# Altium schematic sheet AD8232 & TMP136.SchDoc
size A4; Date: 08-May-2020; ApprovedBy: Vijay; CheckedBy: Vijay; CompanyName: Embdes Engineering Solutions Pvt. Ltd.; DrawnBy: Sandeep G; Organization: Altium Limited; Address1: e2-s.com; DocumentNumber: ECG_BLE.PCBA; Revision: Rev1.0; SheetNumber: 2; SheetTotal: 4; ApprovedByDate: <DATE>; CheckedByDate: <DATE>; DrawnByDate: <DATE>; PageName: AD8232 & TMP136; PageSetup: Record=PageOptions|CenterHorizontal=True|CenterVertical=True|PrintScale=0.71|XCorrection=1.00|YCorrection=1.00|PrintKind=1|BorderSize=5000000|LeftOffset=0|BottomOffset=0|Orientation=2|PaperLength=1000|PaperWidth=1000|Scale=100|PaperSource=15|PrintQuality=-4|MediaType=1|DitherType=10|PaperKind=Ledger.|PrintScaleMode=1; ProjectName: <Project Name>
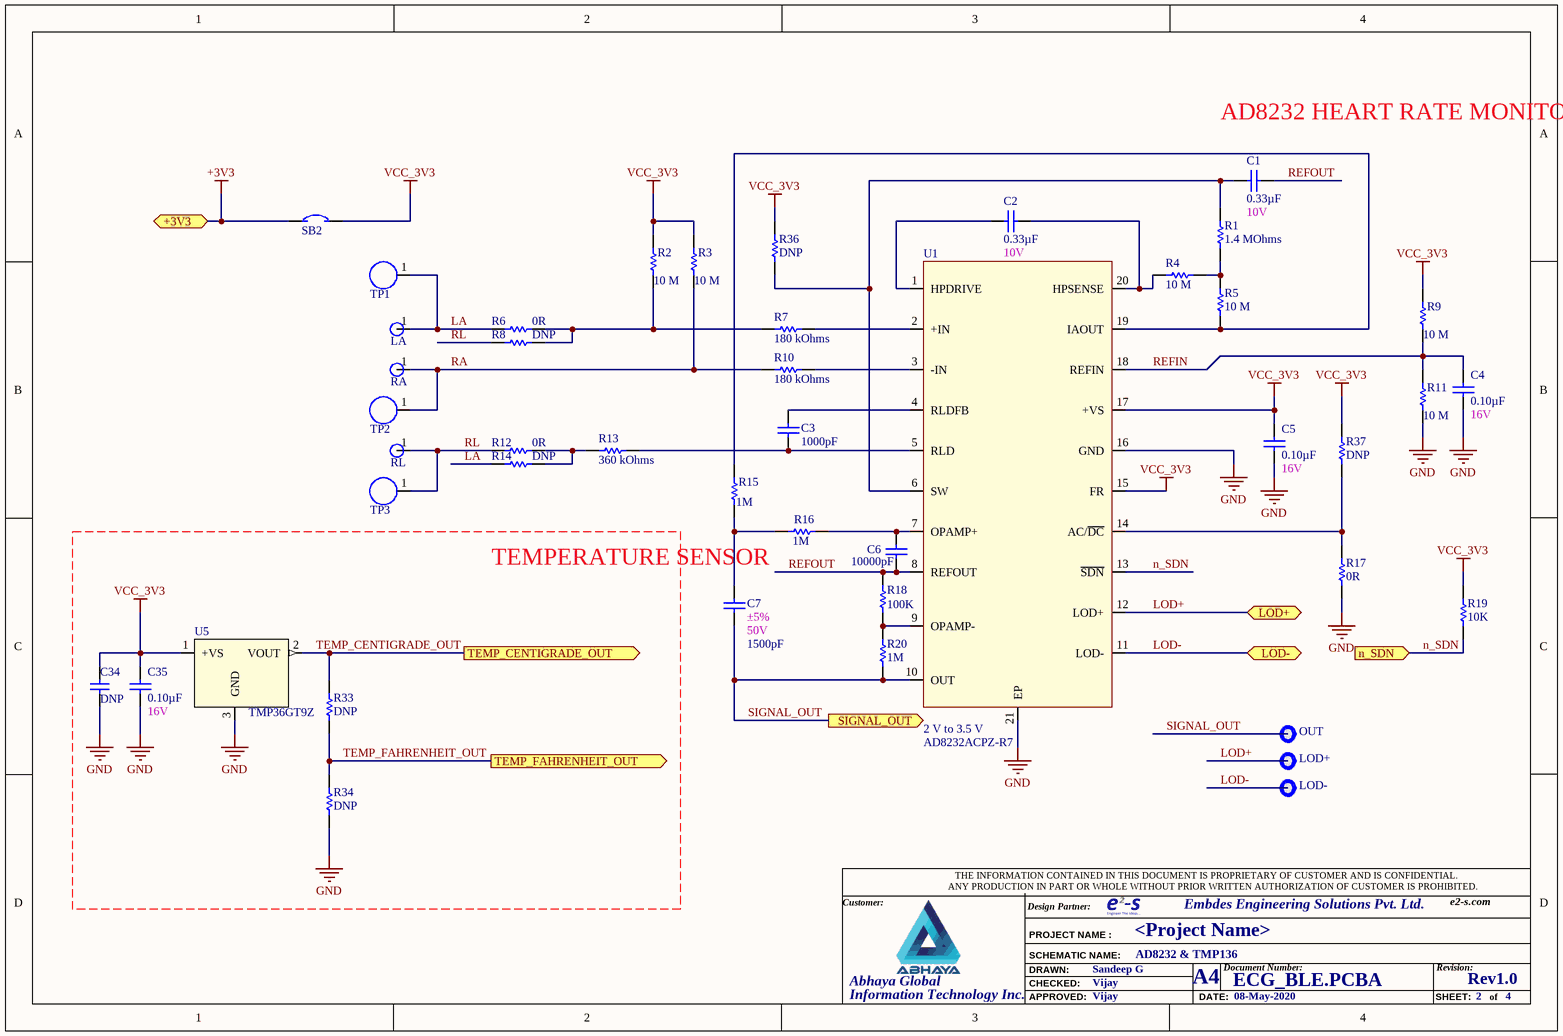
[diagram p0: AD8232 & TMP136.SchDoc]

## Parts
C1  value 0.33µF  1st Auxiliary Field: 10V  [SMDC0402]  (hidden comment: CAP CER 0.33UF 10V X5R 0402)
C2  value 0.33µF  1st Auxiliary Field: 10V  [SMDC0402]  (hidden comment: CAP CER 0.33UF 10V X5R 0402)
C3  value 1000pF  [SMDC0402]  (hidden comment: CAP CER 1000PF 50V X7R 0402)
C4  value 0.10µF  1st Auxiliary Field: 16V  [SMDC0402]  (hidden comment: CAP CER 0.1UF 16V X7R 0402)
C5  value 0.10µF  1st Auxiliary Field: 16V  [SMDC0402]  (hidden comment: CAP CER 0.1UF 16V X7R 0402)
C6  value 10000pF  [SMDCC0402]  (hidden comment: CAP CER 10000PF 50V X7R 0402)
C7  value 1500pF  2nd Auxiliary Field: ±5%  1st Auxiliary Field: 50V  [SMDC0402]  (hidden comment: CAP CER 1500PF 50V X7R 0402)
C34  value DNP  [SMDC0402]  (hidden comment: CAP CER 2.2UF 10V JB 0402)
C35  value 0.10µF  1st Auxiliary Field: 16V  [SMDC0402]  (hidden comment: CAP CER 0.1UF 16V X7R 0402)
LA  Test Point- 1.02mm Hole, 1.52mm Round Pad  [TP_1.02X1.52MM_TH]  (value not drawn)
LOD+  TEST POINT  [TP_40X40]  (value not drawn)
LOD-  TEST POINT  [TP_40X40]  (value not drawn)
OUT  TEST POINT  [TP_40X40]  (value not drawn)
R1  value 1.4 MOhms  [SMDR0402]  (hidden comment: RES 1.4M OHM 1% 1/16W 0402)
R2  value 10 M  [SMDR0402]  (hidden comment: RES SMD 10M OHM 5% 1/10W 0402)
R3  value 10 M  [SMDR0402]  (hidden comment: RES SMD 10M OHM 5% 1/10W 0402)
R4  value 10 M  [SMDR0402]  (hidden comment: RES SMD 10M OHM 5% 1/10W 0402)
R5  value 10 M  [SMDR0402]  (hidden comment: RES SMD 10M OHM 5% 1/10W 0402)
R6  value 0R  [SMDR0402]  (hidden comment: RES SMD 0.0OHM JUMPER 1/10W 0402)
R7  value 180 kOhms  [SMDR0402]  (hidden comment: RES SMD 180K OHM 1% 1/16W 0402)
R8  value DNP  [SMDR0402]  (hidden comment: RES SMD 0.0OHM JUMPER 1/10W 0402)
R9  value 10 M  [SMDR0402]  (hidden comment: RES SMD 10M OHM 5% 1/10W 0402)
R10  value 180 kOhms  [SMDR0402]  (hidden comment: RES SMD 180K OHM 1% 1/16W 0402)
R11  value 10 M  [SMDR0402]  (hidden comment: RES SMD 10M OHM 5% 1/10W 0402)
R12  value 0R  [SMDR0402]  (hidden comment: RES SMD 0.0OHM JUMPER 1/10W 0402)
R13  value 360 kOhms  [SMDR0402]  (hidden comment: RES SMD 360K OHM 1% 1/10W 0402)
R14  value DNP  [SMDR0402]  (hidden comment: RES SMD 0.0OHM JUMPER 1/10W 0402)
R15  value 1M  [SMDR0402]  (hidden comment: RES SMD 1M OHM 1% 1/10W 0402)
R16  value 1M  [SMDR0402]  (hidden comment: RES SMD 1M OHM 1% 1/10W 0402)
R17  value 0R  [SMDR0402]  (hidden comment: RES SMD 0.0OHM JUMPER 1/10W 0402)
R18  value 100K  [SMDRC0402]  (hidden comment: RES SMD 100K OHM 1% 1/10W 0402)
R19  value 10K  [SMDR0402]  (hidden comment: RES SMD 10K OHM 1% 1/10W 0402)
R20  value 1M  [SMDR0402]  (hidden comment: RES SMD 1M OHM 1% 1/10W 0402)
R33  value DNP  [SMDR0402]  (hidden comment: RES 45.3K OHM 0.5% 1/16W 0402)
R34  value DNP  [SMDR0402]  (hidden comment: RES SMD 10K OHM 0.5% 1/16W 0402)
R36  value DNP  [SMDR0402]  (hidden comment: RES SMD 0.0OHM JUMPER 1/10W 0402)
R37  value DNP  [SMDR0402]  (hidden comment: RES SMD 0.0OHM JUMPER 1/10W 0402)
RA  Test Point- 1.02mm Hole, 1.52mm Round Pad  [TP_1.02X1.52MM_TH]  (value not drawn)
RL  Test Point- 1.02mm Hole, 1.52mm Round Pad  [TP_1.02X1.52MM_TH]  (value not drawn)
SB2  EMS_SB0805  [SB_0805]  (value not drawn)  (net tie, no BOM)
TP1  Electrode point  [ELE-MH-6x8MM]  (value not drawn)
TP2  Electrode point  [ELE-MH-6x8MM]  (value not drawn)
TP3  Electrode point  [ELE-MH-6x8MM]  (value not drawn)
U1  value AD8232ACPZ-R7  1st Auxiliary Field: 2 V to 3.5 V  [QFN50P400X400X80_HS-21N]  (hidden comment: Analog Front End - AFE ECG and HRM IC Single Lead)
U5  value TMP36GT9Z  [TO-226-AA]  (hidden comment: SENSOR ANALOG -40C-125C TO92-3)

## Ports
+3V3, LOD+, LOD-, n_SDN (in), SIGNAL_OUT (out), TEMP_CENTIGRADE_OUT (out), TEMP_FAHRENHEIT_OUT (out)

## Nets
+3V3: SB2.1 ; port +3V3
GND: C4.1 C5.1 C34.1 C35.1 R11.1 R17.2 R34.1 U1.16(GND) U1.21(EP) U5.3(GND)
VCC_3V3: C5.2 C34.2 C35.2 R2.2 R3.2 R9.2 R19.1 R36.2 R37.1 SB2.2 U1.15(FR) U1.17(+VS) U5.1(+VS)
LA: LA.1 R6.1 R14.1 TP1.1
LOD+: LOD+.1 U1.12(LOD+) ; port LOD+
LOD-: LOD-.1 U1.11(LOD-) ; port LOD-
n_SDN: R19.2 U1.13(~{SDN}) ; port n_SDN
RA: R3.1 R10.1 RA.1 TP2.1
REFIN: C4.2 R9.1 R11.2 U1.18(REFIN)
REFOUT: C1.2 C6.1 R18.1 U1.8(REFOUT)
RL: R8.1 R12.1 RL.1 TP3.1
SIGNAL_OUT: C7.1 OUT.1 R20.2 U1.10(OUT) ; port SIGNAL_OUT
TEMP_CENTIGRADE_OUT: R33.2 U5.2(VOUT) ; port TEMP_CENTIGRADE_OUT
TEMP_FAHRENHEIT_OUT: R33.1 R34.2 ; port TEMP_FAHRENHEIT_OUT
NetC1_1: C1.1 R1.2 R36.1 U1.6(SW)
NetC2_1: C2.1 U1.1(HPDRIVE)
NetC2_2: C2.2 R4.2 U1.20(HPSENSE)
NetC3_1: C3.1 R13.2 U1.5(RLD)
NetC3_2: C3.2 U1.4(RLDFB)
NetC6_2: C6.2 R16.1 U1.7(OPAMP+)
NetC7_2: C7.2 R15.1 R16.2
NetR1_1: R1.1 R4.1 R5.1
NetR2_1: R2.1 R6.2 R7.1 R8.2
NetR5_2: R5.2 R15.2 U1.19(IAOUT)
NetR7_2: R7.2 U1.2(+IN)
NetR10_2: R10.2 U1.3(-IN)
NetR12_2: R12.2 R13.1 R14.2
NetR17_1: R17.1 R37.2 U1.14(AC/~{DC})
NetR18_2: R18.2 R20.1 U1.9(OPAMP-)

## Notes on the sheet
- AD8232 HEART RATE MONITOR
- TEMPERATURE SENSOR
- Customer:
- Design Partner:
- THE INFORMATION CONTAINED IN THIS DOCUMENT IS PROPRIETARY OF CUSTOMER AND IS CONFIDENTIAL.
- ANY PRODUCTION IN PART OR WHOLE WITHOUT PRIOR WRITTEN AUTHORIZATION OF CUSTOMER IS PROHIBITED.
- Abhaya Global
- DRAWN:
- CHECKED:
- PROJECT NAME :
- SCHEMATIC NAME:
- A4
- Document Number:
- Revision:
- Information Technology Inc.
- APPROVED:
- DATE:
- SHEET:
- of

## Library data of the parts
C1 C2 = ECA0U33L10V0-SB: Manufacturer: Samsung Electro-Mechanics; Manufacturer Part Number: CL05A334KP5NNNC; Vendor Part Number: 1276-6665-1-ND; Temp Co: -55°C ~ 85°C; 3rd Auxiliary Field: ROHS3 Compliant; Component Height (mm): 0.55mm; Vendor Name: Digi-Key; 2nd Auxiliary Field: ±10%; Internal Part Number: ECA0U33L10V0-SB; Part Type: CAP CER 0.33UF 10V X5R 0402; 4th Auxiliary Field: *
C3 = ECA1N00K50V0-SB: Manufacturer: KEMET; Manufacturer Part Number: C0402C102J5RACTU; Vendor Part Number: 399-7754-1-ND; Temp Co: -55°C ~ 125°C; 3rd Auxiliary Field: ROHS3 Compliant; Component Height (mm): 0.55mm; Vendor Name: Digi-Key; 2nd Auxiliary Field: ±5%; Internal Part Number: ECA1N00K50V0-SB; Part Type: CAP CER 1000PF 50V X7R 0402; 4th Auxiliary Field: *; 1st Auxiliary Field: 50V
C4 C5 C35 = ECA0U10K16V0-1-SB: Manufacturer: Samsung Electro-Mechanics America, Inc.; Manufacturer Part Number: CL05B104KO5NNNC; Vendor Part Number: 1276-1001-1-ND; Vendor Name: Digi-Key; 2nd Auxiliary Field: ±10%; Temp Co: X7R; Internal Part Number: ECA0U10K16V0-1-SB; 3rd Auxiliary Field: *; Component Height (mm): *; Part Type: CAP CER 0.1UF 16V X7R 0402; 4th Auxiliary Field: *
C6 = ECA10N0K50V0-SB: Manufacturer Part Number: C0402C103J5RACTU; Manufacturer: Samsung Electro-Mechanics America, Inc.; Vendor Part Number: 399-7758-1-ND; Component Height (mm): 0.55; 4th Auxiliary Field: RoHS Compliant; Vendor Name: Digi-Key; 2nd Auxiliary Field: ±5%; Internal Part Number: ECA10N0K50V0-SB; 3rd Auxiliary Field: *; Part Type: CAP CER 10000PF 50V X7R 0402; Temp Co: X7R; 1st Auxiliary Field: 50V
C7 = ECA1N50K50V0-SB: Manufacturer: Yageo; Vendor Part Number: 311-3763-1-ND; Manufacturer Part Number: CC0402JRX7R9BB152; Vendor Name: Digi-Key; 3rd Auxiliary Field: ROHS3 Compliant; Component Height (mm): 0.55mm; Temp Co: -55°C ~ 125°C; Part Type: CAP CER 1500PF 50V X7R 0402; Internal Part Number: ECA1N50K50V0-SB; 4th Auxiliary Field: *
C34 = ECA2U20L10V-SB: Manufacturer: TDK Corporation; Vendor Part Number: 445-10904-1-ND; Manufacturer Part Number: C1005JB1A225K050BC; 1st Auxiliary Field: 2.2µF; 3rd Auxiliary Field: RoHS Compliant; Component Height (mm): 0.55mm; Temperature Coefficient: -25°C ~ 85°C; Vendor Name: Digi-Key; 2nd Auxiliary Field: ±10%; Internal part Number: ECA2U20L10V-SB; Part Type: CAP CER 2.2UF 10V JB 0402; 4th Auxiliary Field: 10V
LA RA RL = EMS-TP_1X1.52MM_TH: Internal Part Number: EMS-TP_1X1.52MM_TH; Component Height (mm): *; Part Type: Test Point- 1.02mm Hole, 1.52mm Round Pad
LOD+ LOD- OUT = EMS-TP40X40-S: 1st Auxiliary Field: Black; Component Height (mm): *; Manufacturer: *; Part Type: TEST POINT; Manufacturer Part Number: *; Internal Part Number: EMS-TP40X40-S
R1 = ERE1M40G116-SB: Manufacturer: Stackpole Electronics Inc; Vendor Part Number: RMCF0402FT1M40CT-ND; Manufacturer Part Number: RMCF0402FT1M40; Vendor Name: Digi-Key; 3rd Auxiliary Field: ROHS3 Compliant; Component Height (mm): 0.40mm; Temp Co: -55°C ~ 155°C; 1st Auxiliary Field: 0.063W, 1/16W; Part Type: RES 1.4M OHM 1% 1/16W 0402; Internal Part Number: ERE1M40G116-SB; 4th Auxiliary Field: *; 2nd Auxiliary Field: ±1%
R2-R5 R9 R11 = ERE10M0K110-SB: Manufacturer Part Number: ERJ-2GEJ106X; Manufacturer: Panasonic Electronic Components; Vendor Part Number: P10MJCT-ND; 3rd Auxiliary Field: ROHS3 Compliant; Component Height (mm): 0.4mm; Temp Co: -55°C ~ 155°C; Vendor Name: Digi-Key; 1st Auxiliary Field: 0.1W; Internal Part Number: ERE10M0K110-SB; Part Type: RES SMD 10M OHM 5% 1/10W 0402; 4th Auxiliary Field: *; 2nd Auxiliary Field: ±5%
R6 R8 R12 R14 R17 R36 R37 = ERE0R00110-SB: Manufacturer: Panasonic Electronic Components; Vendor Part Number: P0.0JCT-ND; Manufacturer Part Number: ERJ-2GE0R00X; Vendor Name: Digi-Key; Component Height (mm): 0.40mm; 1st Auxiliary Field: 0.1W; Part Type: RES SMD 0.0OHM JUMPER 1/10W 0402; Internal Part Number: ERE0R00110-SB; Temp Co: *; 2nd Auxiliary Field: Jumper
R7 R10 = ERE180KG116-SB: Manufacturer: Yageo; Vendor Part Number: 311-180KLRCT-ND; Manufacturer Part Number: RC0402FR-07180KL; Vendor Name: Digi-Key; 3rd Auxiliary Field: ROHS3 Compliant; Component Height (mm): 0.40mm; Temp Co: -55°C ~ 155°C; 1st Auxiliary Field: 0.063W, 1/16W; Part Type: RES SMD 180K OHM 1% 1/16W 0402; Internal Part Number: ERE180KG116-SB; 4th Auxiliary Field: *; 2nd Auxiliary Field: ±1%
R13 = ERE360KG110-SB: Manufacturer: Panasonic Electronic Components; Vendor Part Number: P360KLCT-ND; Manufacturer Part Number: ERJ-2RKF3603X; Vendor Name: Digi-Key; 3rd Auxiliary Field: ROHS3 Compliant; Component Height (mm): 0.40mm; Temp Co: -55°C ~ 155°C; 1st Auxiliary Field: 0.1W, 1/10W; Part Type: RES SMD 360K OHM 1% 1/10W 0402; Internal Part Number: ERE360KG110-SB; 4th Auxiliary Field: *; 2nd Auxiliary Field: ±1%
R15 R16 R20 = ERE1M00G110-SB: Manufacturer Part Number: ERJ-2RKF1004X; Manufacturer: Panasonic Electronic Components; Vendor Part Number: P1.00MLCT-ND; Component Height (mm): 0.40mm; Temp Co: -55°C ~ 155°C; Vendor Name: Digi-Key; 1st Auxiliary Field: 0.1W; Internal Part Number: ERE1M00G110-SB; 3rd Auxiliary Field: *; Part Type: RES SMD 1M OHM 1% 1/10W 0402; 4th Auxiliary Field: *; 2nd Auxiliary Field: ±1%
R18 = ERE100KG110-SB: Manufacturer Part Number: ERJ-2RKF1003X; Manufacturer: Panasonic Electronic Components; Vendor Part Number: P100KLCT-ND; Component Height (mm): 0.40mm; Vendor Name: Digi-Key; Temp Co: ±100ppm/°C; 1st Auxiliary Field: 0.1W; Part Type: RES SMD 100K OHM 1% 1/10W 0402; 3rd Auxiliary Field: *; 4th Auxiliary Field: *; Internal Part Number: ERE100KG110-SB; 2nd Auxiliary Field: ±1%
R19 = ERE10K0G110-SB: Manufacturer: Panasonic Electronic Components; Manufacturer Part Number: ERJ-2RKF1002X; Vendor Part Number: P10.0KLCT-ND; Component Height (mm): 0.40mm; Vendor Name: Digi-Key; Temp Co: ±100ppm/°C; 1st Auxiliary Field: 0.1W; Part Type: RES SMD 10K OHM 1% 1/10W 0402; Internal Part Number: ERE10K0G110-SB; 2nd Auxiliary Field: ±1%
R33 = ERE45K3F116-SB: Manufacturer: Stackpole Electronics Inc; Vendor Part Number: RNCF0402DTE45K3CT-ND; Manufacturer Part Number: RNCF0402DTE45K3; Vendor Name: Digi-Key; 3rd Auxiliary Field: ROHS3 Compliant; Component Height (mm): 0.35mm; Temp Co: -55°C ~ 155°C; 1st Auxiliary Field: 0.063W, 1/16W; Part Type: RES 45.3K OHM 0.5% 1/16W 0402; Internal Part Number: ERE45K3F116-SB; 4th Auxiliary Field: *; 2nd Auxiliary Field: ±0.5%
R34 = ERE10K0F116-SB: Manufacturer: Panasonic Electronic Components; Vendor Part Number: P15984CT-ND; Manufacturer Part Number: ERJ-2RHD1002X; Vendor Name: Digi-Key; 3rd Auxiliary Field: ROHS3 Compliant; Component Height (mm): 0.40mm; Temp Co: -55°C ~ 125°C; 1st Auxiliary Field: 0.063W, 1/16W; Part Type: RES SMD 10K OHM 0.5% 1/16W 0402; Internal Part Number: ERE10K0F116-SB; 4th Auxiliary Field: *; 2nd Auxiliary Field: ±0.5%
SB2 = EMS_SB0805: *; Manufacturer: *; Part Type: *; Vendor Name: *; Vendor Part Number: *; 3rd Auxiliary Field: *; Manufacturer Part Number: *; Internal Part Number: EMS_SB0805; 4th Auxiliary Field: *; Component Height (mm): *; Temp Co: *; 2nd Auxiliary Field: *; 1st Auxiliary Field: *; Value: *
TP1-TP3 = EMS-ELE_6X8MM_TH: Internal Part Number: EMS-ELE_6X8MM_TH; Component Height (mm): *; Part Type: Electrode point
U1 = EICADLFCSP-20-1862: Manufacturer: Analog Devices; Vendor Part Number: 584-AD8232ACPZ-R7; 2nd Auxiliary Field: 170 uA; 3rd Auxiliary Field: RoHS Compliant; Component Height (mm): 0.8mm; Temp Co: -40°C ~ 85°C; Vendor Name: Mouser; 4th Auxiliary Field: *; Internal Part Number: EICADLFCSP-20-1862; Part Type: Analog Front End - AFE ECG and HRM IC Single Lead; Manufacturer Part Number: AD8232ACPZ-R7
U5 = EICADTO92-3-1865: Manufacturer: Analog Devices Inc.; Vendor Part Number: TMP36GT9Z-ND; 2nd Auxiliary Field: 10mV/°C; 3rd Auxiliary Field: RoHS Compliant; Component Height (mm): 18.03mm; Temp Co: 25°C (-40°C ~ 125°C); Vendor Name: Digi-Key; 1st Auxiliary Field: 2.7V ~ 5.5V; 4th Auxiliary Field: *; Internal Part Number: EICADTO92-3-1865; Part Type: SENSOR ANALOG -40C-125C TO92-3; Manufacturer Part Number: TMP36GT9Z